# EAGLE design AKLM-1.4 (EAGLE 7.7.0)
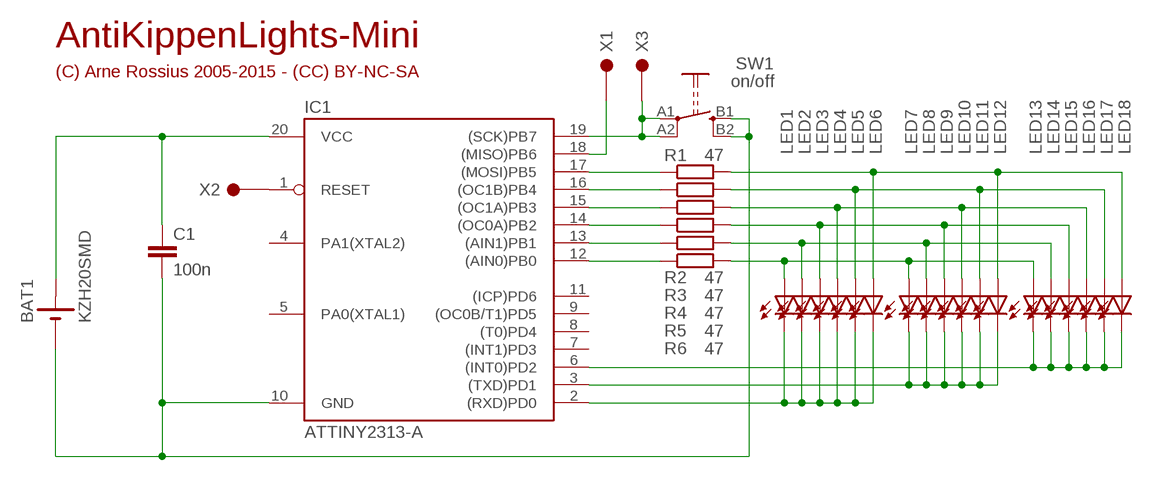
[diagram p0: schematic, sheet 1]

## Parts
BAT1  KZH20SMD  [KZH20SMD]
C1  100n  C-EUC0805  [C0805]
IC1  ATTINY2313-A  [SO20W]
LED1  LED_0805  [CHIPLED_0805]
LED2  LED_0805  [CHIPLED_0805]
LED3  LED_0805  [CHIPLED_0805]
LED4  LED_0805  [CHIPLED_0805]
LED5  LED_0805  [CHIPLED_0805]
LED6  LED_0805  [CHIPLED_0805]
LED7  LED_0805  [CHIPLED_0805]
LED8  LED_0805  [CHIPLED_0805]
LED9  LED_0805  [CHIPLED_0805]
LED10  LED_0805  [CHIPLED_0805]
LED11  LED_0805  [CHIPLED_0805]
LED12  LED_0805  [CHIPLED_0805]
LED13  LED_0805  [CHIPLED_0805]
LED14  LED_0805  [CHIPLED_0805]
LED15  LED_0805  [CHIPLED_0805]
LED16  LED_0805  [CHIPLED_0805]
LED17  LED_0805  [CHIPLED_0805]
LED18  LED_0805  [CHIPLED_0805]
R1  47  R-EU_R0805  [R0805]
R2  47  R-EU_R0805  [R0805]
R3  47  R-EU_R0805  [R0805]
R4  47  R-EU_R0805  [R0805]
R5  47  R-EU_R0805  [R0805]
R6  47  R-EU_R0805  [R0805]
SW1  on/off  LSG_KEY_(SCHURTER)  [LSG-KEY]
X1  SMDPAD-75  [SMDPAD_75MIL]
X2  SMDPAD-75  [SMDPAD_75MIL]
X3  SMDPAD-75  [SMDPAD_75MIL]

## Nets
N$1: IC1.17((MOSI)PB5) R1.1
N$2: IC1.16((OC1B)PB4) R2.1
N$3: IC1.15((OC1A)PB3) R3.1
N$4: IC1.14((OC0A)PB2) R4.1
N$5: IC1.13((AIN1)PB1) R5.1
N$6: IC1.12((AIN0)PB0) R6.1
N$7: LED1.A LED7.A LED13.A R6.2
N$8: LED2.A LED8.A LED14.A R5.2
N$9: LED3.A LED9.A LED15.A R4.2
N$10: LED4.A LED10.A LED16.A R3.2
N$11: LED5.A LED11.A LED17.A R2.2
N$12: LED6.A LED12.A LED18.A R1.2
N$13: IC1.2((RXD)PD0) LED1.C LED2.C LED3.C LED4.C LED5.C LED6.C
N$14: IC1.3((TXD)PD1) LED7.C LED8.C LED9.C LED10.C LED11.C LED12.C
N$15: IC1.6((INT0)PD2) LED13.C LED14.C LED15.C LED16.C LED17.C LED18.C
N$16: IC1.19((SCK)PB7) SW1.A1(P) SW1.A2(P) X3.PAD
N$17: BAT1.POS(+) C1.1 IC1.20(VCC)
N$18: BAT1.NEG(-) C1.2 IC1.10(GND) SW1.B1(S) SW1.B2(S)
N$19: IC1.18((MISO)PB6) X1.PAD
N$20: IC1.1(RESET) X2.PAD
Unconnected: IC1.4(PA1(XTAL2)) IC1.5(PA0(XTAL1)) IC1.7((INT1)PD3) IC1.8((T0)PD4) IC1.9((OC0B/T1)PD5) IC1.11((ICP)PD6)

## Notes on the sheet
- AntiKippenLights-Mini
- (C) Arne Rossius 2005-2015 - (CC) BY-NC-SA

## Library data of the parts
BAT1 = battery:KZH20SMD
C1 = rcl:C-EU: CAPACITOR, European symbol
IC1 = ic-atmel:ATTINY2313
LED1-LED18 = led:LED_
R1-R6 = rcl:R-EU_: RESISTOR, European symbol
SW1 = _custom:LSG_KEY_(SCHURTER)
X1-X3 = con-pads:SMDPAD

## Board
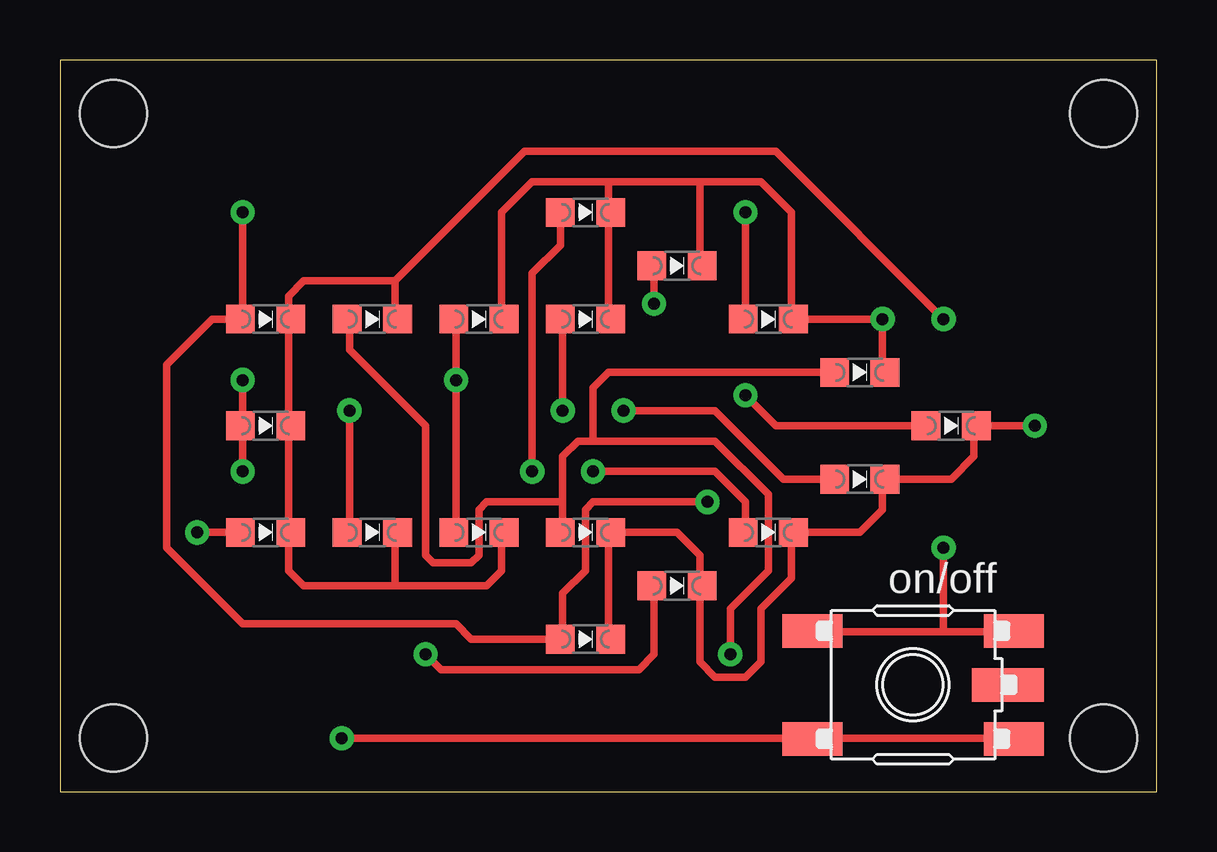
[diagram p1: board, top side]
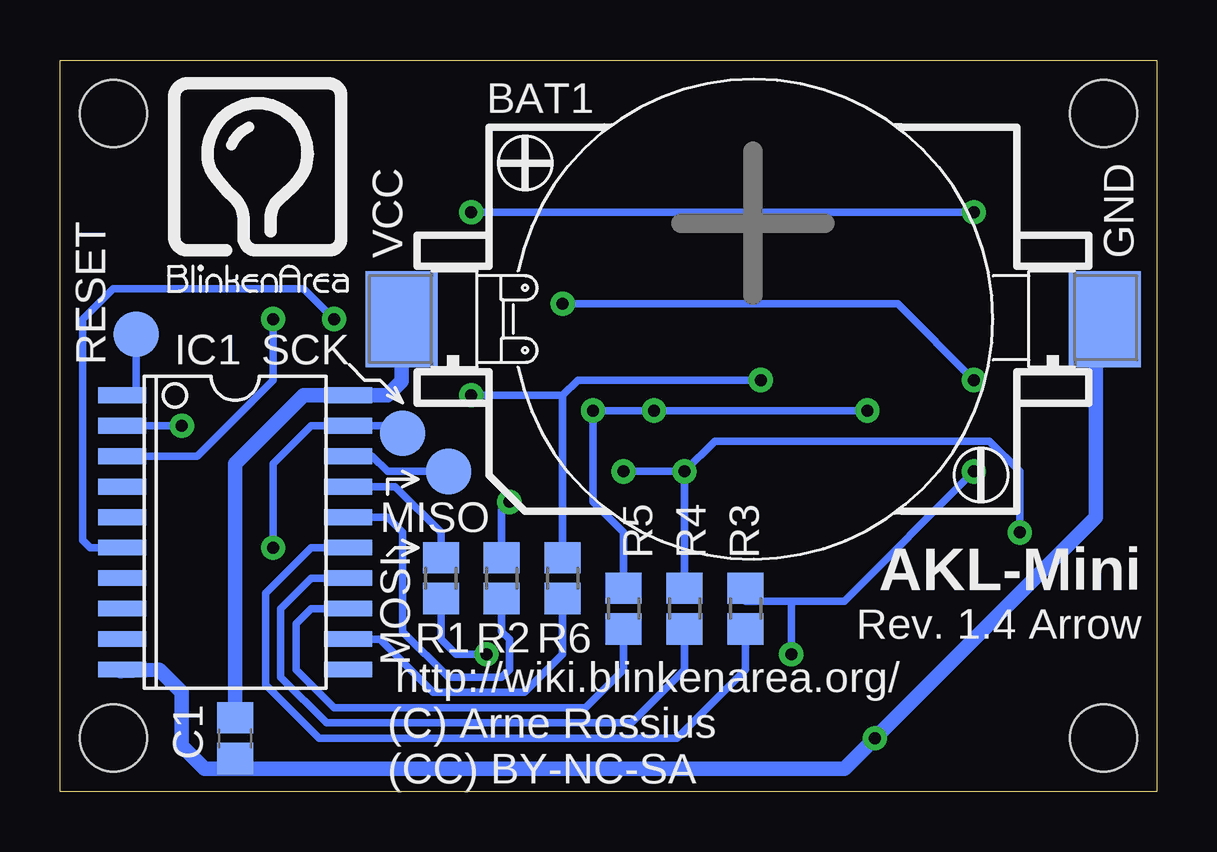
[diagram p2: board, bottom side, seen from below]

Size 45.72 x 30.48 mm. Coordinates in mm from the lower left corner, seen from the top.
Outline: 0,0 45.72,0 45.72,30.48 0,30.48 0,0
Copper layers (1*16): Top 0.035mm / dielectric 1.5mm / Bottom 0.035mm
Design rules "default": minimum track width 12mil, minimum drill 0.5mm, track to track 11mil, track to pad 11mil, pad to pad 11mil, via to via 11mil, smd to smd 11mil, copper to edge 15mil, drill to drill 8mil, minimum pad ring 10mil, minimum via ring 10mil, stop-mask expansion 2mil, vias tented up to drill 30mil, thermal gap 10mil
Holes 2.8 mm at 43.5,28.26 2.22,28.26 43.5,2.22 2.22,2.22

### Footprints (pad centres in the part's own frame; a part is rotated, then mirrored left to right if it is on the bottom)
KZH20SMD = smd 3 x 4: NEG -14.65,0; POS 14.65,0
C0805 = smd 1.3 x 1.5: 1 -0.85,0; 2 0.85,0
SO20W = smd 0.65 x 2: 1 -5.715,-4.7; 2 -4.445,-4.7; 3 -3.175,-4.7; 4 -1.905,-4.7; 5 -0.635,-4.7; 6 0.635,-4.7; 7 1.905,-4.7; 8 3.175,-4.7; 9 4.445,-4.7; 10 5.715,-4.7; 11 5.715,4.7; 12 4.445,4.7; 13 3.175,4.7; 14 1.905,4.7; 15 0.635,4.7; 16 -0.635,4.7; 17 -1.905,4.7; 18 -3.175,4.7; 19 -4.445,4.7; 20 -5.715,4.7
CHIPLED_0805 = smd 1.2 x 1.2: A 0,-1.05; C 0,1.05
R0805 = smd 1.3 x 1.5: 1 -0.85,0; 2 0.85,0
LSG-KEY = smd 2.5 x 1.4: A1 -4.2,2.25; A2 4.2,2.25; B1 -4.2,-2.25; B2 4.2,-2.25 | smd 3 x 1.4: HOUSING 3.95,0
SMDPAD_75MIL = smd 1.905 x 1.905: PAD 0,0

### Placement (x,y rotation side)
BAT1  16.83,19.68 180 bottom
C1  38.42,2.22 270 bottom
IC1  38.42,10.79 270 bottom
LED1  37.15,15.24 270 top
LED2  33.34,13.02 270 top
LED3  29.53,10.79 270 top
LED4  25.72,8.57 270 top
LED5  21.91,6.35 270 top
LED6  21.91,10.79 270 top
LED7  17.46,10.79 270 top
LED8  13.02,10.79 270 top
LED9  8.57,10.79 270 top
LED10  8.57,15.24 270 top
LED11  8.57,19.68 270 top
LED12  13.02,19.68 270 top
LED13  17.46,19.68 270 top
LED14  21.91,19.68 270 top
LED15  21.91,24.13 270 top
LED16  25.72,21.91 270 top
LED17  29.53,19.68 270 top
LED18  33.34,17.46 270 top
R1  29.84,8.89 270 bottom
R2  27.3,8.89 90 bottom
R3  17.14,7.62 90 bottom
R4  19.68,7.62 90 bottom
R5  22.23,7.62 90 bottom
R6  24.77,8.89 90 bottom
SW1  35.56,4.45 0 top
U$2  [LOGO_07.5MM]  37.47,26.04 0 bottom
X1  29.53,13.34 0 bottom
X2  42.55,19.05 0 bottom
X3  31.43,14.92 0 bottom

### Tracks (layer width: path | path; a pad name or v marks a point on that pad's centre or on a via)
N$1
  Bottom 0.305: R1.1 29.84,10.79 31.75,12.7 IC1.17
N$2
  Bottom 0.305: IC1.16 32.07,11.43 31.43,10.79 31.43,6.67 29.53,4.76 27.3,4.76 26.99,5.08 26.99,6.35 27.3,6.67 R2.1
N$3
  Bottom 0.305: R3.1 17.14,5.08 20,2.22 34.92,2.22 37.15,4.45 37.15,8.26 35.24,10.16 IC1.15
N$4
  Bottom 0.305: R4.1 19.68,5.08 21.91,2.86 34.61,2.86 36.51,4.76 36.51,7.62 35.24,8.89 IC1.14
N$5
  Bottom 0.305: R5.1 22.23,5.08 23.81,3.49 34.29,3.49 35.88,5.08 35.88,6.99 35.24,7.62 IC1.13
N$6
  Bottom 0.305: R6.1 24.77,5.71 26.35,4.13 30.16,4.13 32.38,6.35 IC1.12
N$7  (via drill 0.5 pad 1)
  Top 0.305: LED7.A 16.51,10.79 v16.51,17.14 16.51,19.68 LED13.A | v28.57,16.51 29.84,15.24 LED1.A
  Bottom 0.305: 24.77,16.51 R6.2 | v16.51,17.14 24.13,17.14 24.77,16.51 | 24.77,16.51 v28.57,16.51
N$8  (via drill 0.5 pad 1)
  Top 0.305: LED14.A 20.95,19.68 v20.95,15.88 | LED2.A 30.16,13.02 27.3,15.88 v23.5,15.88 | LED8.A 12.06,10.79 v12.06,15.88
  Bottom 0.305: R5.2 22.23,10.79 23.5,12.06 v23.5,15.88 v20.95,15.88 v12.06,15.88
N$9  (via drill 0.5 pad 1)
  Top 0.305: LED9.A v5.71,10.79 | LED15.A 20.86,22.76 19.68,21.59 v19.68,13.34 | LED3.A 28.57,10.79 28.57,12.06 27.3,13.34 v22.23,13.34
  Bottom 0.305: v19.68,13.34 R4.2 | v19.68,13.34 18.41,14.61 6.99,14.61 5.71,13.34 v5.71,10.79 | v19.68,13.34 v22.23,13.34
N$10  (via drill 0.5 pad 1)
  Top 0.305: 7.62,15.24 v7.62,13.34 | LED16.A 24.77,21.91 v24.77,20.32 | LED10.A 7.62,15.24 | 7.62,15.24 v7.62,17.14 | LED4.A 24.77,8.89 24.77,5.71 24.13,5.08 15.88,5.08 v15.24,5.71
  Bottom 0.305: v7.62,13.34 13.02,7.94 15.24,7.94 | v24.77,20.32 10.79,20.32 v7.62,17.14 | 15.24,7.94 v15.24,5.71 | R3.2 17.14,7.94 15.24,7.94
N$11  (via drill 0.5 pad 1)
  Top 0.305: v7.62,24.13 7.62,19.68 LED11.A 6.35,19.68 4.45,17.78 4.45,10.16 7.62,6.99 16.51,6.99 17.14,6.35 LED5.A 20.95,6.35 20.95,8.26 21.91,9.21 21.91,11.75 22.23,12.06 v26.99,12.06 | LED17.A 28.57,19.68 v28.57,24.13
  Bottom 0.305: R2.2 27.3,11.75 v26.99,12.06 | v7.62,24.13 v28.57,24.13
N$12  (via drill 0.5 pad 1)
  Top 0.305: v27.94,5.71 27.94,7.62 29.53,9.21 29.53,12.38 27.3,14.61 22.23,14.61 | LED6.A 20.95,10.79 20.95,12.06 | 22.23,14.61 21.59,14.61 20.95,13.97 20.95,12.06 | 20.95,12.06 17.78,12.06 17.46,11.75 17.46,9.84 17.14,9.53 15.56,9.53 15.24,9.84 15.24,15.24 12.06,18.41 12.06,19.68 LED12.A | LED18.A 22.86,17.46 22.23,16.83 22.23,14.61
  Bottom 0.305: v27.94,5.71 29.21,5.71 29.84,6.35 R1.2
N$13  (via drill 0.5 pad 1)
  Top 0.305: 22.86,10.79 LED6.C | 30.48,10.79 33.34,10.79 34.29,11.75 34.29,13.02 | 34.29,13.02 37.15,13.02 38.1,13.97 38.1,15.24 LED1.C v40.64,15.24 | 26.67,8.57 26.67,5.4 27.3,4.76 28.57,4.76 29.21,5.4 29.21,7.62 30.48,8.89 30.48,10.79 | 30.48,10.79 LED3.C | 34.29,13.02 LED2.C | LED5.C 22.86,6.35 22.86,10.79 | 22.86,10.79 25.72,10.79 26.67,9.84 26.67,8.57 | 26.67,8.57 LED4.C
  Bottom 0.305: v40.64,15.24 IC1.2
N$14  (via drill 0.5 pad 1)
  Top 0.305: 9.53,10.79 9.53,15.24 | 9.53,15.24 9.53,19.68 | 9.53,15.24 LED10.C | LED12.C 13.97,19.68 13.97,21.27 | 13.97,21.27 10.16,21.27 9.53,20.64 9.53,19.68 | 9.53,19.68 LED11.C | 9.53,10.79 LED9.C | 9.53,10.79 9.53,9.21 10.16,8.57 13.97,8.57 | LED8.C 13.97,10.79 13.97,8.57 | LED7.C 18.41,10.79 18.41,9.21 17.78,8.57 13.97,8.57 | 13.97,21.27 19.37,26.67 29.84,26.67 v36.83,19.68
  Bottom 0.305: IC1.3 40.01,13.97 36.83,17.14 v36.83,19.68
N$15  (via drill 0.5 pad 1)
  Top 0.305: LED13.C 18.41,19.68 18.41,24.13 19.68,25.4 22.86,25.4 | LED16.C 26.67,21.91 26.67,25.4 | 22.86,25.4 26.67,25.4 | LED14.C 22.86,19.68 22.86,24.13 | 22.86,24.13 LED15.C | 22.86,25.4 22.86,24.13 | LED18.C 34.29,17.46 v34.29,19.68 30.48,19.68 | 26.67,25.4 29.21,25.4 30.48,24.13 30.48,19.68 | 30.48,19.68 LED17.C
  Bottom 0.305: IC1.6 44.45,10.16 44.77,10.48 44.77,19.68 43.5,20.95 35.56,20.95 v34.29,19.68
N$16  (via drill 0.5 pad 1)
  Top 0.305: SW1.A2 39.73,6.67 36.83,6.67 | SW1.A1 31.39,6.67 36.83,6.67 | 36.83,6.67 v36.83,10.16
  Bottom 0.305: v36.83,10.16 36.83,13.65 35.24,15.24 IC1.19 31.75,15.24 X3.PAD
N$17
  Bottom 0.61: C1.1 38.42,13.65 35.56,16.51 IC1.20 32.07,16.51 31.48,17.1 BAT1.POS
N$18  (via drill 0.5 pad 1)
  Top 0.305: 31.36,2.22 SW1.B1 31.39,2.22 v11.75,2.22 39.76,2.22 SW1.B2
  Bottom 0.305: 43.18,5.02 IC1.10
  Bottom 0.61: 38.42,0.95 13.02,0.95 v11.75,2.22 2.54,11.43 2.54,19.68 BAT1.NEG | 38.42,0.95 39.69,0.95 40.64,1.91 40.64,4.13 41.59,5.08 43.18,5.02 | 38.42,0.95 C1.2
N$19
  Bottom 0.305: X1.PAD 32.07,13.34 32.7,13.97 IC1.18
N$20
  Bottom 0.305: IC1.1 42.55,16.51 X2.PAD

### Text on the board
tPlace: on/off
bPlace: GND | VCC | SCK | RESET | MISO | AKL-Mini | MOSI | Rev. 1.4 Arrow | http://wiki.blinkenarea.org/ | (C) Arne Rossius | (CC) BY-NC-SA
bNames: BAT1